# Altium project pcb-force-box.PrjPcb
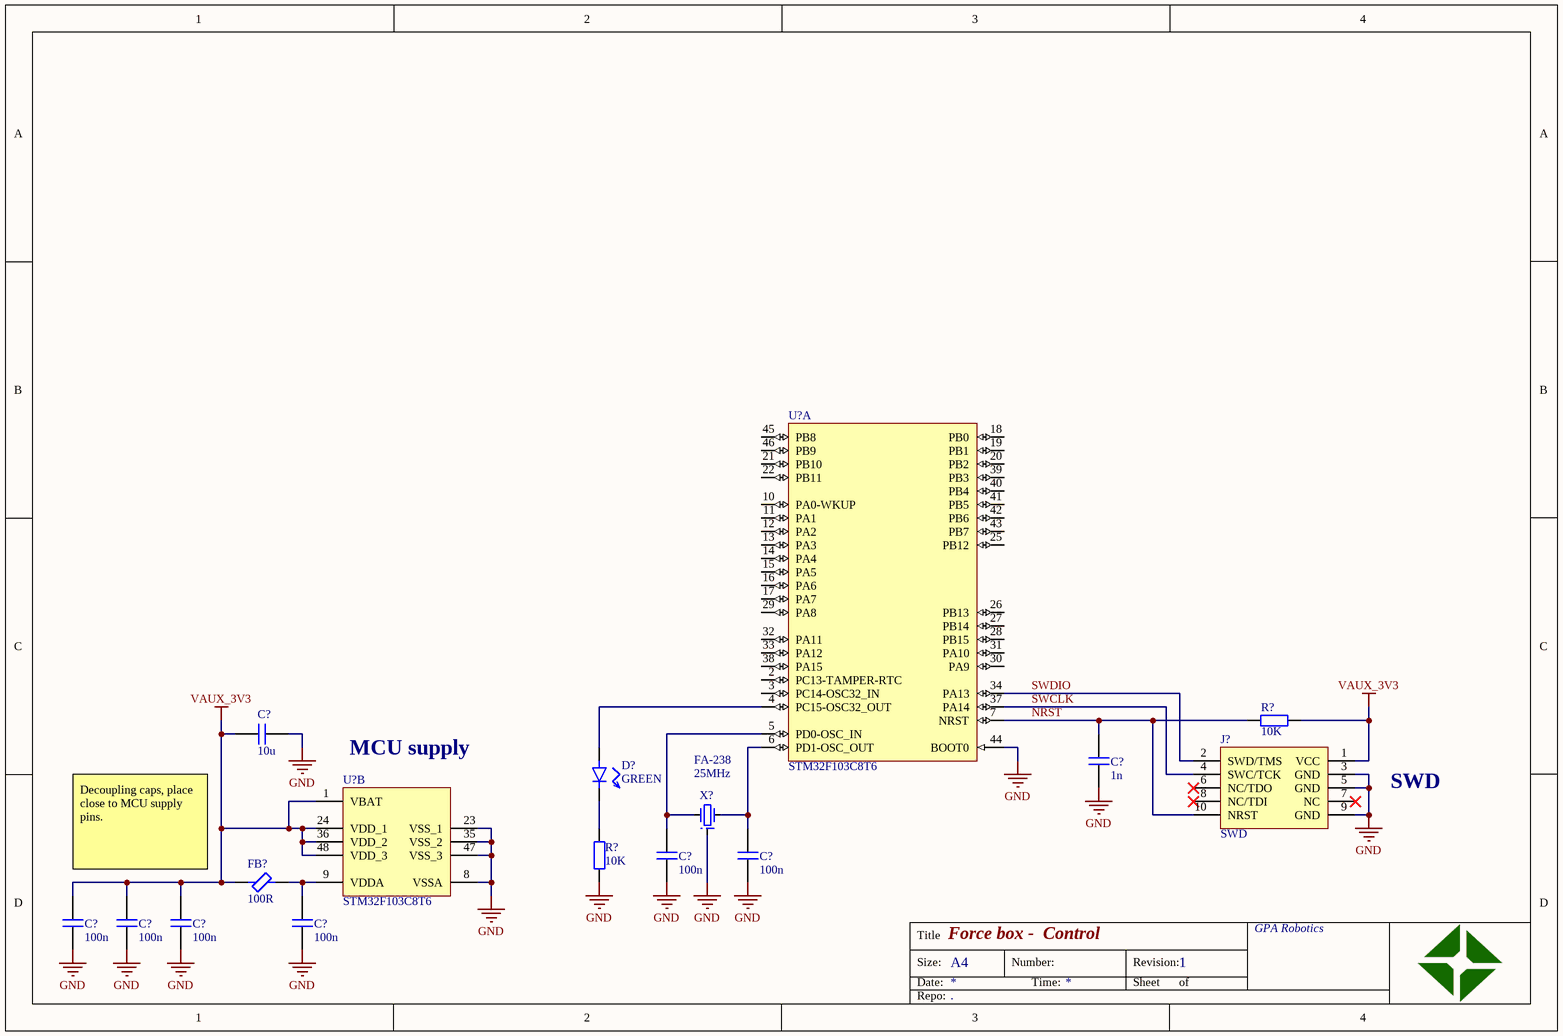
[diagram p0: control.SchDoc]
project_author: Gustav Palmqvist; project_name: Force box; project_repo: .; project_revision: 1
4 sheets, 16 parts. Net scope: global (net labels, ports and power ports of the same name join across sheets).
Sheets:
  cover.SchDoc
  control.SchDoc
  latch_driver.SchDoc
  actuator_driver.SchDoc

## Sheet cover.SchDoc: Cover
size A4; Organization: GPA Robotics

### Notes on the sheet
- Variant:
- Title
- Size:
- Date:
- A4
- Number:
- Time:
- Revision:
- Sheet
- of
- Repo:

## Sheet control.SchDoc: Control
size A4; Organization: GPA Robotics; Revision: REV 0

### Parts
(Parts that share a designator on the sheet are numbered #1, #2 ... from top to bottom, then left to right.)
C?#1  value 10u  [CAPC3216X14N]  (hidden comment: cap)
C?#2  value 1n  [CAPC1005X06N]  (hidden comment: cap)
C?#3  value 100n  [CAPC1005X06N]  (hidden comment: cap)
C?#4  value 100n  [CAPC1005X06N]  (hidden comment: cap)
C?#5  value 100n  [CAPC1005X06N]  (hidden comment: cap)
C?#6  value 100n  [CAPC1005X06N]  (hidden comment: cap)
C?#7  value 100n  [CAPC1005X06N]  (hidden comment: cap)
C?#8  value 100n  [CAPC1005X06N]  (hidden comment: cap)
D?  value GREEN  [CAPCP1005X06N]  (hidden comment: led)
FB?  value 100R  [INDC1005X06N]  (hidden comment: ferrite)
J?  SWD  [hdr_2x5_50mil]
R?#1  value 10K  [RESC1005X04N]  (hidden comment: res)
R?#2  value 10K  [RESC1005X04N]  (hidden comment: res)
U?#1  STM32F103C8T6  [STM-LQFP48_N]  (part A of 2)
U?#2  STM32F103C8T6  [STM-LQFP48_N]  (part B of 2)
X?  FA-238  freq: 25MHz  [DFN220P320X70-4N]

### Nets
GND: C?#1.2 C?#2.1 C?#3.1 C?#4.1 C?#5.1 C?#6.1 C?#7.1 C?#8.1 J?.3(GND) J?.5(GND) J?.9(GND) R?#2.1 U?#1.44(BOOT0) U?#2.8(VSSA) U?#2.23(VSS_1) U?#2.35(VSS_2) U?#2.47(VSS_3) X?.SHIELD
VAUX_3V3: C?#1.1 C?#5.2 C?#6.2 C?#7.2 FB?.1 J?.1(VCC) R?#1.1 U?#2.1(VBAT) U?#2.24(VDD_1) U?#2.36(VDD_2) U?#2.48(VDD_3)
NRST: C?#2.2 J?.10(NRST) R?#1.2 U?#1.7(NRST)
SWCLK: J?.4(SWC/TCK) U?#1.37(PA14)
SWDIO: J?.2(SWD/TMS) U?#1.34(PA13)
NetC?#3_2: C?#3.2 U?#1.5(PD0-OSC_IN) X?.1
NetC?#4_2: C?#4.2 U?#1.6(PD1-OSC_OUT) X?.2
NetC?#8_2: C?#8.2 FB?.2 U?#2.9(VDDA)
NetD?_A: D?.A U?#1.4(PC15-OSC32_OUT)
NetD?_C: D?.C R?#2.2

Not connected (* = marked no-connect by the designer): J? 6(NC/TDO)* 7(NC)* 8(NC/TDI)*; U?#1 2(PC13-TAMPER-RTC) 3(PC14-OSC32_IN) 10(PA0-WKUP) 11(PA1) 12(PA2) 13(PA3) 14(PA4) 15(PA5) 16(PA6) 17(PA7) 18(PB0) 19(PB1) 20(PB2) 21(PB10) 22(PB11) 25(PB12) 26(PB13) 27(PB14) 28(PB15) 29(PA8) 30(PA9) 31(PA10) 32(PA11) 33(PA12) 38(PA15) 39(PB3) 40(PB4) 41(PB5) 42(PB6) 43(PB7) 45(PB8) 46(PB9)

### Notes on the sheet
- (near U?#2) MCU supply
- SWD
- Decoupling caps, place close to MCU supply pins.
- Title
- Size:
- Date:
- A4
- Number:
- Time:
- Revision:
- Sheet
- of
- Repo:

### Library data of the parts
C?#1-C?#8 = cap: Capacitor; voltage: *; type: *; #digikey: *; #mouser: *
D? = led: pin to pad: A>1 C>2
FB? = ferrite: Inductor; #digikey: *; #mouser: *
J? = hdr_swd: SWD Header
R?#1 R?#2 = res: Resistor; power: *; voltage: *; #digikey: *; #mouser: *
U?#1 U?#2 = STM32F103C8T6: ARM Cortex-M3 32-bit MCU, 64 KB Flash, 20 KB Internal RAM, 37 I/Os, 48-pin LQFP, -40 to 85 degC, Tray; A/D Converter: 2x12-bit (10 Channel); FLASH Size (Prog) (kB): 64; I/Os (High Current): 37; Internal RAM Size (kB): 20; Operating Frequency(F) (Processor speed) (MHz): 72; Supply Voltage(Vcc) min (V): 2; DatasheetVersion: Rev. 16; PackageVersion: Rev. 6, 06/2013; PackageReference: LQFP48; PackageDescription: 48-Pin Low Profile Quad Flat Package, 7 x 7 mm Body, 0.5 mm Pitch; Supplier 1: Digi-Key; Supplier Part Number 1: 497-6063-ND; Supplier 2: Farnell; Supplier Part Number 2: 1447637; Supplier 3: Newark; Supplier Part Number 3: 59M2182; Supplier 4: Newark; Supplier Part Number 4: 57P1222; Supplier 5: Mouser; Supplier Part Number 5: 511-STM32F103C8T6; Core: ARM Cortex-M3; Packing: Tray; Mounting Technology: Surface Mount; PartNumber: STM32F103C8T6; ComponentLink1Description: Manufacturer URL; ComponentLink1URL: http://www.st.com/web/en/home.html; ComponentLink2Description: Datasheet; ComponentLink2URL: http://www.st.com/st-web-ui/static/active/en/resource/technical/document/datasheet/CD00161566.pdf; ComponentLink3Description: Package Specification; ComponentLink3URL: http://www.st.com/st-web-ui/static/active/en/resource/technical/document/datasheet/DM00058181.pdf
X? = crystal: Crystal With Shield; #digikey: *; #mouser: *

## Sheet latch_driver.SchDoc: Latch
size A4; Organization: GPA Robotics; Revision: REV 0

### Notes on the sheet
- Title
- Size:
- Date:
- A4
- Number:
- Time:
- Revision:
- Sheet
- of
- Repo:

## Sheet actuator_driver.SchDoc
size A4; Organization: GPA Robotics; Revision: REV 0

### Notes on the sheet
- Title
- Size:
- Date:
- A4
- Number:
- Time:
- Revision:
- Sheet
- of
- Repo: